# EAGLE design paste_injector (EAGLE 8.5.0)
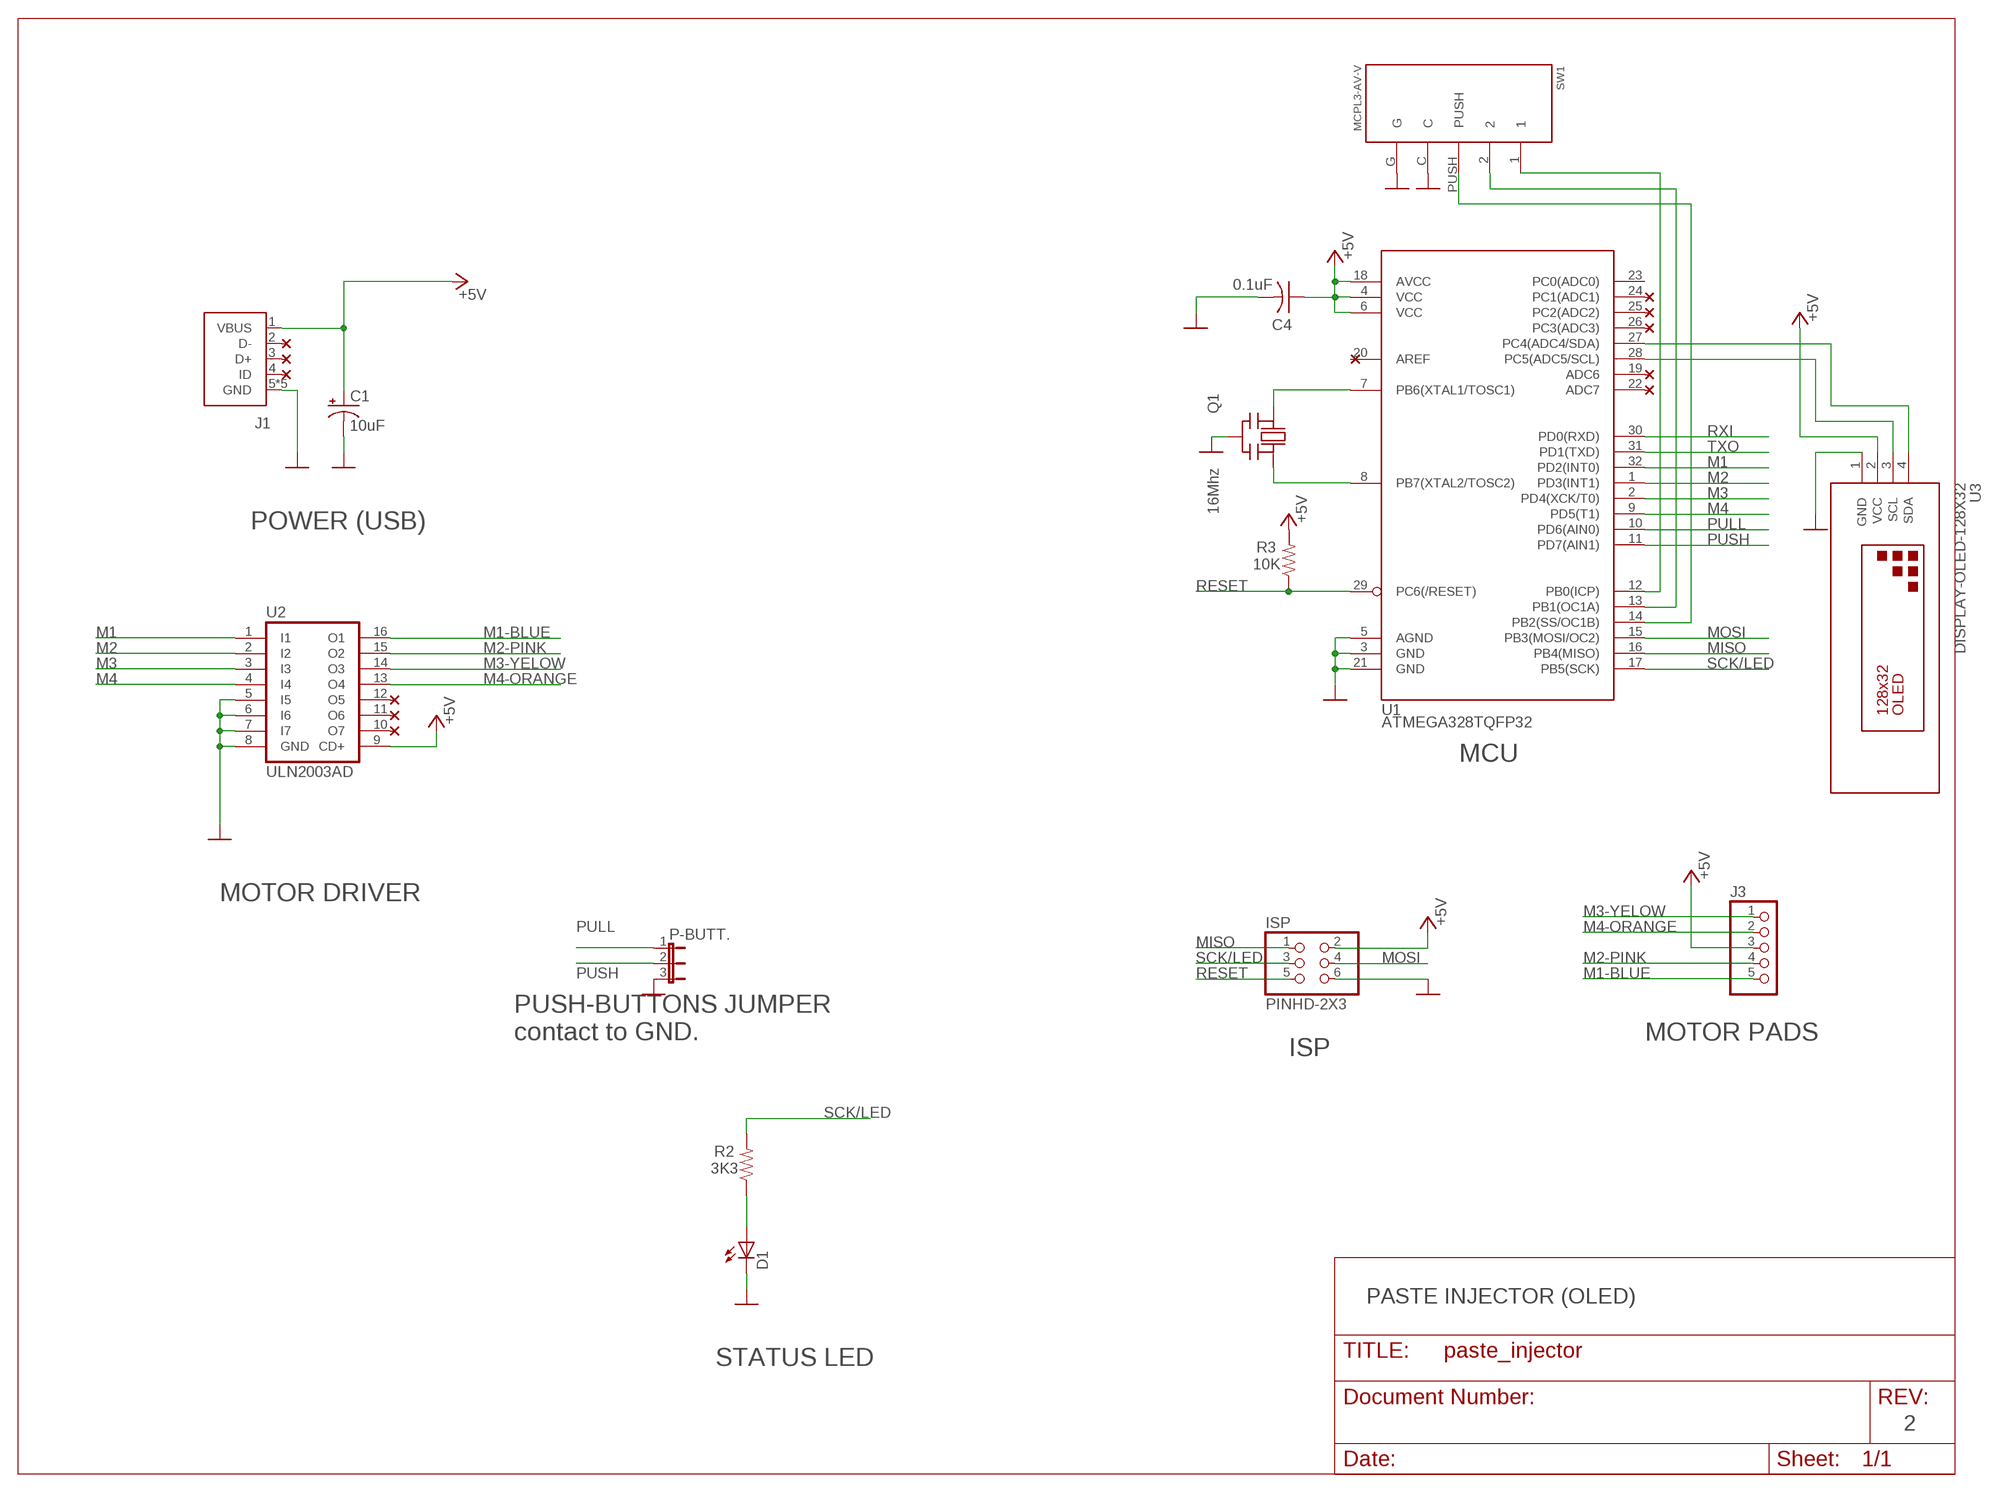
[diagram p0: schematic, sheet 1]

## Parts
C1  10uF  CPOL-USA/3216-18R  [A/3216-18R]
C4  0.1uF  CAP-C0603  [C0603]
D1  LED  [LED0603]
ISP  PINHD-2X3  [2X03]
J1  USB  [USB-MICRO-ZX62RD-AB-5P8]
J3  PINHD-1X5  [1X05]
P-BUTT.  JP2E  [JP2]
Q1  16Mhz  CERMOSCILL-CSTCRG  [CSTCR-G]
R2  3K3  RES-R0603  [R0603]
R3  10K  RES-R0603  [R0603]
SW1  MCPL3-AV-V  [MCPL3-AC-V]
U1  ATMEGA328TQFP32  [TQFP32-08]
U2  ULN2003AD  [SO16]
U3  DISPLAY-OLED-128X32  [DISPLAY-OLED-128X32]

## Nets
+5V [power]: C1.+ C4.1 ISP.2 J1.1(VBUS) J3.3 R3.2 U1.4(VCC) U1.6(VCC) U1.18(AVCC) U2.9(CD+) U3.2(VCC)
GND [power]: C1.- C4.2 D1.C ISP.6 J1.5(GND) J1.A(GND) J1.B(GND) J1.C(GND) J1.D(GND) P-BUTT..3 Q1.2(GND) SW1.C SW1.G U1.3(GND) U1.5(AGND) U1.21(GND) U2.5(I5) U2.6(I6) U2.7(I7) U2.8(GND) U3.1(GND)
M1: U1.32(PD2(INT0)) U2.1(I1)
M1-BLUE: J3.5 U2.16(O1)
M2: U1.1(PD3(INT1)) U2.2(I2)
M2-PINK: J3.4 U2.15(O2)
M3: U1.2(PD4(XCK/T0)) U2.3(I3)
M3-YELOW: J3.1 U2.14(O3)
M4: U1.9(PD5(T1)) U2.4(I4)
M4-ORANGE: J3.2 U2.13(O4)
MISO: ISP.1 U1.16(PB4(MISO))
MOSI: ISP.4 U1.15(PB3(MOSI/OC2))
N$1: D1.A R2.1
N$2: Q1.1(IN) U1.7(PB6(XTAL1/TOSC1))
N$3: U1.27(PC4(ADC4/SDA)) U3.4(SDA)
N$4: U1.28(PC5(ADC5/SCL)) U3.3(SCL)
N$5: SW1.1 U1.12(PB0(ICP))
N$6: SW1.2 U1.13(PB1(OC1A))
N$7: Q1.3(OUT) U1.8(PB7(XTAL2/TOSC2))
N$8: SW1.PUSH U1.14(PB2(SS/OC1B))
PULL: P-BUTT..1 U1.10(PD6(AIN0))
PUSH: P-BUTT..2 U1.11(PD7(AIN1))
RESET: ISP.5 R3.1 U1.29(PC6(/RESET))
RXI: U1.30(PD0(RXD))
SCK/LED: ISP.3 R2.2 U1.17(PB5(SCK))
TXO: U1.31(PD1(TXD))
Unconnected: J1.2(D-) J1.3(D+) J1.4(ID) U1.19(ADC6) U1.20(AREF) U1.22(ADC7) U1.23(PC0(ADC0)) U1.24(PC1(ADC1)) U1.25(PC2(ADC2)) U1.26(PC3(ADC3)) U2.10(O7) U2.11(O6) U2.12(O5)

## Notes on the sheet
- POWER (USB)
- MCU
- MOTOR DRIVER
- PUSH-BUTTONS JUMPER
  contact to GND.
- MOTOR PADS
- ISP
- PASTE INJECTOR (OLED)
- STATUS LED
- 2

## Library data of the parts
C1 = paste_injector:CPOL-US
C4 = paste_injector:CAP-: CAPACITOR, American symbol
D1 = paste_injector:LED
ISP = paste_injector:PINHD-2X3
J1 = paste_injector:USB
J3 = paste_injector:PINHD-1X5: PIN HEADER
P-BUTT. = jumper:JP2E: JUMPER
Q1 = adafruit:CERMOSCILL: Ceramic oscillator with built in capacitors such as ZTT-12MHz http://www.ladyada.net/library/eagle
R2 R3 = paste_injector:RES-: RESISTOR, American symbol
SW1 = lbrzak:MCPL3-AV-V
U1 = paste_injector:ATMEGA328
U2 = paste_injector:ULN2003A: DRIVER ARRAY
U3 = diy-modules:DISPLAY-OLED-128X32: 128x32 Dot Matrix OLED Module with I2C interface based on SSD1306 chip More details available here: http://www.tinyosshop.com/index.php?route=product/product&product_id=953 Schematic available here: http://www.tinyosshop.com/datasheet/OLED%2012832.pdf SSD1306 datasheet: https://cdn-shop.adafruit.com/datasheets/SSD1306.pdf Click here to find device on ebay.com <http://www.ebay.com/sch/oled+display+128x32+i2c>

## Net classes
1 power: width 0.305 mm

## Board
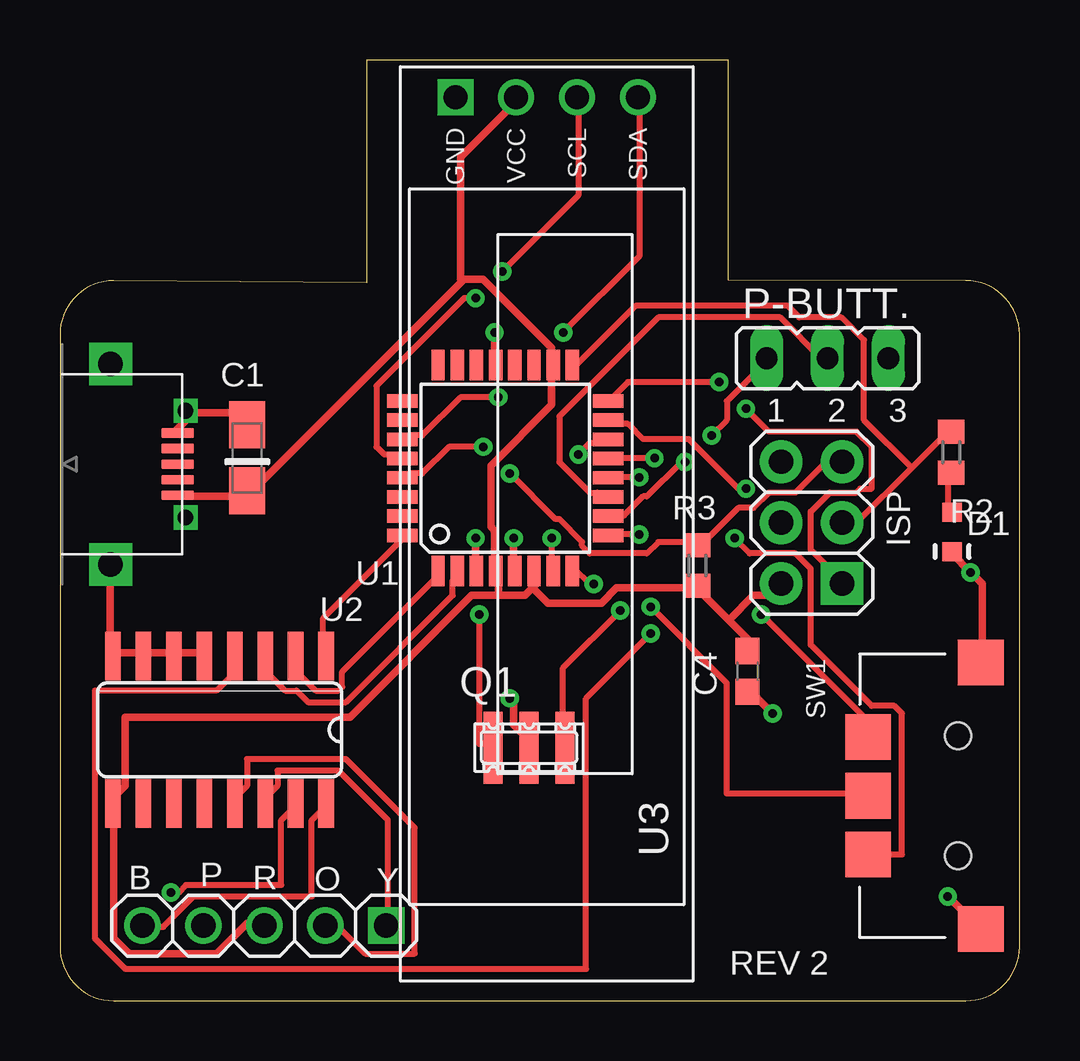
[diagram p1: board, top side]
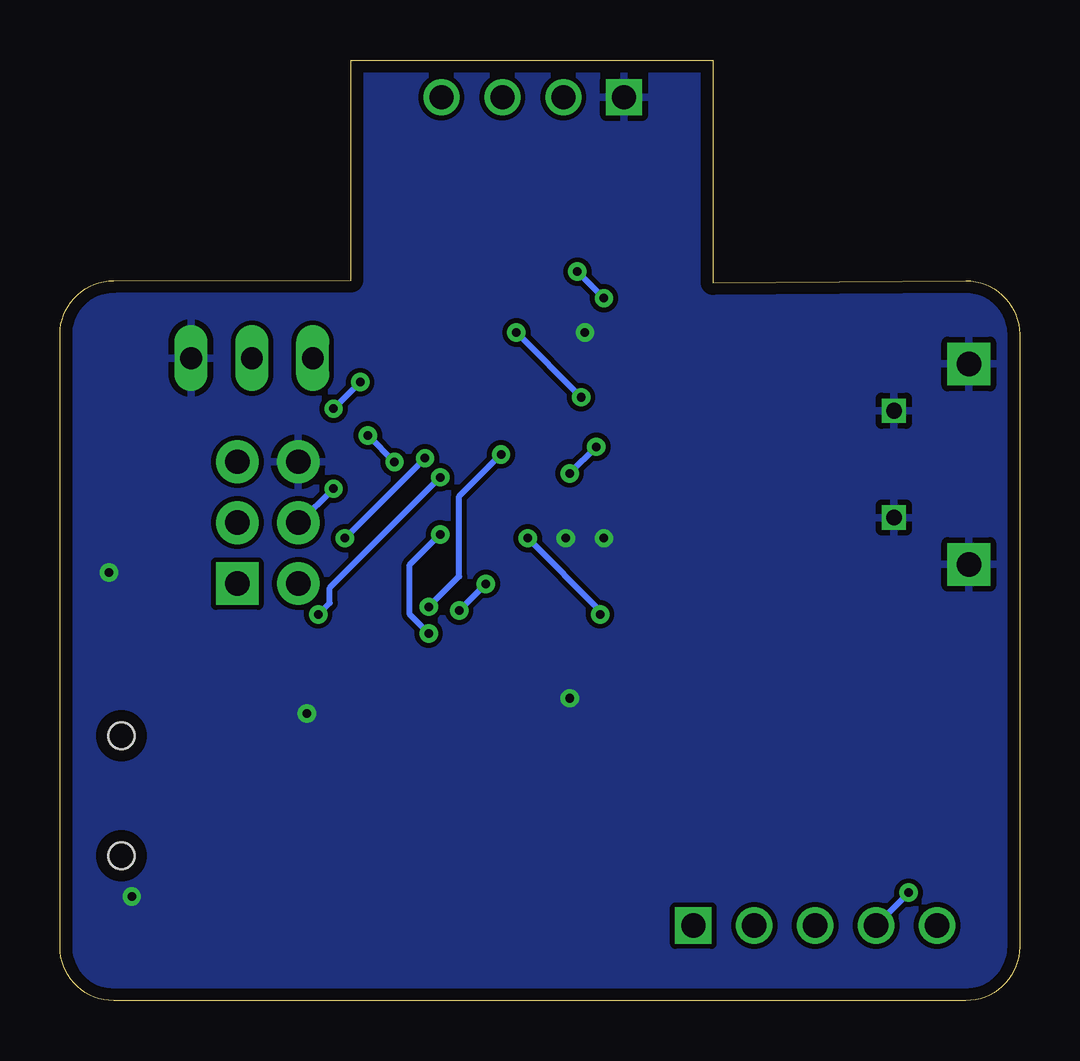
[diagram p2: board, bottom side, seen from below]

Size 40 x 39.19 mm. Coordinates in mm from the lower left corner, seen from the top.
Outline: 40,2.24 40,27.76 arc90 37.76,30 27.86,30.02 27.86,39.2 12.77,39.2 12.77,29.92 2.24,30 arc90 0,27.76 0,2.24 arc90 2.24,0 37.76,0 arc90 40,2.24
Copper layers (1*16): Top 0.035mm / dielectric 1.5mm / Bottom 0.035mm
Design rules "default *": minimum track width 10mil, minimum drill 14mil, track to track 8mil, track to pad 8mil, pad to pad 8mil, via to via 8mil, smd to smd 8mil, copper to edge 20mil, drill to drill 8mil, minimum pad ring 7mil, minimum via ring 8mil, stop-mask expansion 4mil, vias tented up to drill 20mil, thermal gap 10mil

### Footprints (pad centres in the part's own frame; a part is rotated, then mirrored left to right if it is on the bottom)
A/3216-18R = smd 1.95 x 1.5: + 1.375,0; - -1.375,0
C0603 = smd 1.1 x 1: 1 -0.85,0; 2 0.85,0
LED0603 = smd 0.8 x 0.8: A 0,-0.825; C 0,0.825
2X03 = drill 1.016 pad 1.778 square: 1 -2.54,-1.27 | drill 1.016 pad 1.778: 2 -2.54,1.27; 3 0,-1.27; 4 0,1.27; 5 2.54,-1.27; 6 2.54,1.27
USB-MICRO-ZX62RD-AB-5P8 = smd 0.4 x 1.35: 1 1.3,5.425; 2 0.65,5.425; 3 0,5.425; 4 -0.65,5.425; 5 -1.3,5.425 | drill 1.016 pad 1.778 square: A -4.175,2.625; D 4.175,2.625 | drill 0.65 pad 0.914 square: B -2.225,5.75; C 2.225,5.75
1X05 = drill 1.016 square: 1 -5.08,0 | drill 1.016: 2 -2.54,0; 3 0,0; 4 2.54,0; 5 5.08,0
JP2 = drill 0.914 long: 1 -2.54,0; 2 0,0; 3 2.54,0
CSTCR-G = smd 0.8 x 3: 1 -1.5,0; 2 0,0; 3 1.5,0
R0603 = smd 1 x 1.1: 1 -0.85,0; 2 0.85,0
MCPL3-AC-V = smd 1.9 x 1.9: 1 -2.45,-3.75; 2 2.45,-3.75; C 5.55,0.95; G -5.55,0.95; PUSH 0,-3.75 | hole 1.1: -2.5,0; 2.5,0
TQFP32-08 = smd 1.27 x 0.559: 1 -4.293,2.8; 2 -4.293,2; 3 -4.293,1.2; 4 -4.293,0.4; 5 -4.293,-0.4; 6 -4.293,-1.2; 7 -4.293,-2; 8 -4.293,-2.8; 17 4.293,-2.8; 18 4.293,-2; 19 4.293,-1.2; 20 4.293,-0.4; 21 4.293,0.4; 22 4.293,1.2; 23 4.293,2; 24 4.293,2.8 | smd 0.559 x 1.27: 9 -2.8,-4.293; 10 -2,-4.293; 11 -1.2,-4.293; 12 -0.4,-4.293; 13 0.4,-4.293; 14 1.2,-4.293; 15 2,-4.293; 16 2.8,-4.293; 25 2.8,4.293; 26 2,4.293; 27 1.2,4.293; 28 0.4,4.293; 29 -0.4,4.293; 30 -1.2,4.293; 31 -2,4.293; 32 -2.8,4.293
SO16 = smd 0.66 x 2.032: 1 -4.445,-3.073; 2 -3.175,-3.073; 3 -1.905,-3.073; 4 -0.635,-3.073; 5 0.635,-3.073; 6 1.905,-3.073; 7 3.175,-3.073; 8 4.445,-3.073; 9 4.445,3.073; 10 3.175,3.073; 11 1.905,3.073; 12 0.635,3.073; 13 -0.635,3.073; 14 -1.905,3.073; 15 -3.175,3.073; 16 -4.445,3.073
DISPLAY-OLED-128X32 = drill 1 square: 1 -17.78,-3.81 | drill 1: 2 -17.78,-1.27; 3 -17.78,1.27; 4 -17.78,3.81

### Placement (x,y rotation side)
C1  7.81,22.62 270 top
C4  28.66,13.72 270 top
D1  37.19,19.53 180 top
ISP  31.34,19.92 90 top
J1  -0.51,22.35 270 top
J3  8.52,3.13 180 top
P-BUTT.  32,26.77 0 top
Q1  19.55,10.54 0 top
R2  37.15,22.85 90 top
R3  26.57,18.13 270 top
SW1  37.43,8.54 270 top
U1  18.56,22.19 90 top
U2  6.65,11.29 180 top
U3  20.29,19.87 270 top

### Tracks (layer width: path | path; a pad name or v marks a point on that pad's centre or on a via)
+5V
  Top 0.305: 16.77,29.98 7.96,21.17 C1.+ 7.96,21.02 4.94,21.02 J1.1 | 16.77,29.98 16.85,30.06 17.64,30.06 20.5,27.21 20.5,26.73 20.66,26.57 U1.18 20.66,26.41 20.5,26.25 20.5,24.82 17.96,22.29 17.96,19.75 18.12,19.59 18.12,18 U1.4 18.12,17.84 18.28,17.68 18.28,16.89 | U3.2 19.07,37.53 16.69,35.14 16.69,30.06 16.77,29.98 | J3.3 8.43,3.23 7.8,3.23 6.53,1.97 2.88,1.97 2.24,2.6 2.24,8 2.08,8.16 U2.9 2.08,8.31 2.72,8.95 2.72,11.81 12.09,11.81 17.17,16.89 18.28,16.89 | 18.28,16.89 19.39,16.89 19.71,17.2 | 19.71,17.2 19.86,17.36 19.86,17.84 U1.6 | 27.88,15.86 28.75,14.98 28.75,14.66 C4.1 | 27.88,15.86 26.53,17.2 R3.2 26.37,17.2 23.2,17.2 22.56,16.57 20.34,16.57 19.71,17.2 | 27.88,15.86 28.91,16.89 29.39,16.89 30.02,17.52 ISP.2
GND  (via drill 0.36)
  Top 0.305: U2.5 5.89,14.51 4.94,14.51 4.78,14.35 U2.6 4.62,14.51 3.67,14.51 3.51,14.35 U2.7 3.35,14.51 2.4,14.51 2.24,14.35 U2.8 2.24,14.51 2.08,14.66 2.08,18.16 J1.D | D1.C 37.17,18.63 v37.96,17.84 38.44,17.36 38.44,14.19 SW1.G | v29.71,11.97 28.75,12.92 C4.2 | v17.32,19.27 17.32,18.16 17.48,18 U1.3 | v18.91,19.27 18.91,18.16 19.07,18 U1.5 | v18.12,27.84 18.12,26.73 18.28,26.57 U1.21 | J1.5 4.78,23.71 5.26,24.19 5.26,24.51 J1.B 5.42,24.51 7.16,24.51 7.8,23.87 C1.- | v37.01,4.35 38.28,3.08 SW1.C | v18.75,12.6 18.91,12.6 18.91,11.49 19.71,10.7 Q1.2
  pour Bottom: 0,-0.02 0,29.97 12.85,29.85 12.64,39.27 28.01,39.25 28.04,30.05 27.93,29.97 40.03,29.97 40,0
M1
  Top 0.254: U1.32 14.31,19.27 10.97,15.93 10.97,14.51 U2.1
M1-BLUE
  Top 0.254: U2.16 11.13,8.16 10.5,7.52 10.5,4.35 5.58,4.35 4.31,3.08 3.51,3.08 J3.5
M2
  Top 0.254: U1.1 15.9,17.84 11.77,13.71 11.77,13.08 11.61,12.92 10.66,12.92 9.7,13.87 9.7,14.35 U2.2
M2-PINK  (via drill 0.36)
  Top 0.254: v4.62,4.5 4.94,4.5 5.26,4.82 9.23,4.82 9.23,7.52 9.86,8.16 U2.15
  Bottom 0.254: v4.62,4.5 5.89,3.23 J3.4
M3
  Top 0.254: U1.2 16.69,17.84 16.37,17.52 16.37,16.89 11.93,12.44 10.34,12.44 9.86,12.92 9.39,12.92 8.43,13.87 8.43,14.35 U2.3
M3-YELOW
  Top 0.254: U2.14 8.43,8.31 9.07,8.95 9.07,9.58 11.61,9.58 13.67,7.52 13.67,3.23 J3.1
M4  (via drill 0.36)
  Top 0.254: v24.15,19.43 23.04,19.43 22.88,19.27 U1.9 | v24.63,15.3 21.93,12.6 21.93,1.33 2.72,1.33 1.45,2.6 1.45,12.92 6.53,12.92 7.32,13.71 7.32,14.35 U2.4
  Bottom 0.254: v24.15,19.43 25.42,18.16 25.42,16.09 v24.63,15.3
M4-ORANGE
  Top 0.254: U2.13 7.16,8.31 7.8,8.95 7.8,10.06 11.93,10.06 14.78,7.2 14.78,1.97 12.72,1.97 11.45,3.23 11.13,3.23 J3.2
MISO  (via drill 0.36)
  Top 0.254: v27.48,25.78 23.67,25.78 22.88,24.98 U1.16 | v28.6,24.67 29.55,23.71 33.2,23.71 33.83,23.08 33.83,21.33 33.36,21.33 33.2,21.17 32.09,21.17 31.29,20.38 31.29,18.79 32.56,17.52 ISP.1
  Bottom 0.254: v28.6,24.67 v27.48,25.78
MOSI  (via drill 0.36)
  Top 0.254: v28.6,21.33 28.28,21.33 26.21,23.4 24.31,23.4 23.67,24.03 23.04,24.03 22.88,24.19 U1.15
  Bottom 0.254: v28.6,21.33 30.02,19.9 ISP.4
N$1
  Top 0.254: D1.A 37.33,20.38 37.01,20.7 37.01,21.97 R2.1
N$2  (via drill 0.36)
  Top 0.254: v20.5,19.27 20.5,18.16 20.66,18 U1.7 | v17.48,16.09 17.48,10.7 17.96,10.7 Q1.1
  Bottom 0.254: v20.5,19.27 17.48,16.25 v17.48,16.09
N$3  (via drill 0.36)
  Top 0.254: v18.28,25.14 16.69,25.14 15.1,23.55 14.63,23.55 14.31,23.24 U1.27 | v20.98,27.84 24.15,31.02 24.15,37.53 U3.4
  Bottom 0.254: v20.98,27.84 v18.28,25.14
N$4  (via drill 0.36)
  Top 0.254: v17.32,29.27 16.85,29.27 13.2,25.62 13.2,23.08 13.51,22.76 13.83,22.76 14.15,22.44 U1.28 | v18.44,30.38 21.61,33.56 21.61,37.53 U3.3
  Bottom 0.254: v18.44,30.38 v17.32,29.27
N$5  (via drill 0.36)
  Top 0.254: v24.15,21.81 23.04,21.81 22.88,21.65 U1.12 | v29.23,16.09 33.83,11.49 33.83,11.01 SW1.1
  Bottom 0.254: v24.15,21.81 28.75,17.2 28.75,16.57 v29.23,16.09
N$6  (via drill 0.36)
  Top 0.254: v24.79,22.6 23.04,22.6 22.88,22.44 U1.13 | v28.12,19.27 28.75,18.63 30.66,18.63 31.29,18 31.29,14.82 33.83,12.28 34.79,12.28 35.1,11.97 35.1,6.09 33.83,6.09 SW1.2
  Bottom 0.254: v28.12,19.27 v24.79,22.6
N$7  (via drill 0.36)
  Top 0.254: v22.25,17.36 22.09,17.36 21.45,18 U1.8 | v23.36,16.25 20.98,13.87 20.98,10.7 Q1.3
  Bottom 0.254: v23.36,16.25 v22.25,17.36
N$8  (via drill 0.36)
  Top 0.254: v21.61,22.76 22.09,23.24 22.56,23.24 22.72,23.4 U1.14 | v24.63,16.41 27.8,13.24 27.8,8.63 33.68,8.63 SW1.PUSH
  Bottom 0.254: v21.61,22.76 23.36,21.02 23.36,17.68 v24.63,16.41
PULL  (via drill 0.36)
  Top 0.254: v26.06,22.44 25.9,22.44 24.47,21.02 24.31,21.02 23.52,20.22 23.04,20.22 22.88,20.06 U1.10 | v27.17,23.55 27.8,24.19 27.8,24.98 29.55,26.73 P-BUTT..1
  Bottom 0.254: v27.17,23.55 v26.06,22.44
PUSH
  Top 0.254: U1.11 22.72,20.86 22.4,21.17 22.09,21.17 20.82,22.44 20.82,24.35 24.94,28.48 30.02,28.48 31.77,26.73 31.93,26.73 P-BUTT..2
RESET  (via drill 0.36)
  Top 0.254: ISP.5 32.56,22.6 32.09,22.6 30.66,21.17 29.55,21.17 28.91,20.54 28.28,20.54 26.69,18.95 R3.1 26.53,19.11 24.94,19.11 24.47,18.63 22.09,18.63 21.77,18.95 21.77,19.11 20.82,20.06 20.66,20.06 v18.75,21.97 | v17.64,23.08 16.21,23.08 15.1,21.97 14.63,21.97 14.31,21.65 U1.29
  Bottom 0.254: v18.75,21.97 v17.64,23.08
SCK/LED
  Top 0.254: 35.5,22.2 33.2,19.9 32.72,19.9 ISP.3 | 35.5,22.2 37.01,23.71 R2.2 | 35.5,22.2 33.52,24.19 33.52,27.52 32.56,28.48 30.82,28.48 30.34,28.95 23.99,28.95 21.45,26.41 U1.17

### Text on the board
tPlace: B | P | R | O | Y | REV 2